# Altium project PCB_Snippets.PrjPcb
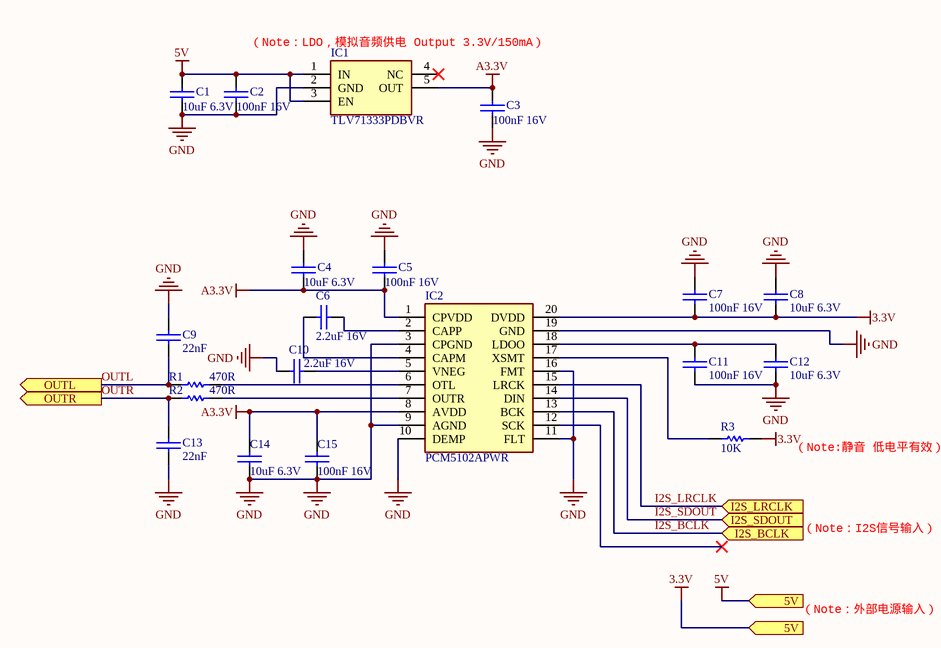
[diagram p0: PCM5102A .SchDoc]
1 sheet, 20 parts. Net scope: flat (ports and power ports of the same name join across sheets).
Board file: PCB1.PcbDoc

## Sheet PCM5102A .SchDoc
size A4

### Parts
C1  10uF 6.3V  [0603C]
C2  100nF 16V  [0402C]
C3  100nF 16V  [0402C]
C4  10uF 6.3V  [0603C]
C5  100nF 16V  [0402C]
C6  2.2uF 16V  [0402C]
C7  100nF 16V  [0402C]
C8  10uF 6.3V  [0603C]
C9  22nF  [0402C]
C10  2.2uF 16V  [0402C]
C11  100nF 16V  [0402C]
C12  10uF 6.3V  [0603C]
C13  22nF  [0402C]
C14  10uF 6.3V  [0603C]
C15  100nF 16V  [0402C]
IC1  TLV71333PDBVR  [SOT95P280X145-5N]
IC2  PCM5102APWR  [SOP65P640X120-20N]
R1  470R  [0402R]
R2  470R  [0402R]
R3  10K  [0402R]

### Ports
5V (in), I2S_BCLK (in), I2S_LRCLK (in), I2S_SDOUT (in), OUTL (out), OUTR (out)

### Nets
3.3V: C1.2 C2.2 C7.1 C8.1 IC1.1(IN) IC1.3(EN) IC2.20(DVDD) R3.1 ; port 5V  [also labelled 5V]
A3.3V: C3.2 C4.1 C5.1 C14.2 C15.2 IC1.5(OUT) IC2.1(CPVDD) IC2.8(AVDD)
GND: C1.1 C2.1 C3.1 C4.2 C5.2 C7.2 C8.2 C9.2 C10.2 C11.1 C12.1 C13.1 C14.1 C15.1 IC1.2(GND) IC2.3(CPGND) IC2.9(AGND) IC2.10(DEMP) IC2.11(FLT) IC2.16(FMT) IC2.19(GND)
I2S_BCLK: IC2.13(BCK) ; port I2S_BCLK
I2S_LRCLK: IC2.15(LRCK) ; port I2S_LRCLK
I2S_SDOUT: IC2.14(DIN) ; port I2S_SDOUT
OUTL: C9.1 R1.2 ; port OUTL
OUTR: C13.2 R2.2 ; port OUTR
NetC6_1: C6.1 IC2.2(CAPP)
NetC6_2: C6.2 IC2.4(CAPM)
NetC10_1: C10.1 IC2.5(VNEG)
NetC11_2: C11.2 C12.2 IC2.18(LDOO)
NetIC2_6: IC2.6(OTL) R1.1
NetIC2_7: IC2.7(OUTR) R2.1
NetIC2_17: IC2.17(XSMT) R3.2

Not connected (* = marked no-connect by the designer): IC1 4(NC)*; IC2 12(SCK)*

### Notes on the sheet
- (near IC1) （Note：LDO，模拟音频供电 Output 3.3V/150mA）
- （Note:静音 低电平有效）
- （Note：I2S信号输入）
- （Note：外部电源输入）

### Library data of the parts
C1-C15 = CAP-NP
IC1 = TLV71333PDBVR: Integrated Circuit; Manufacturer_Name: Texas Instruments; Datasheet Link: http://www.ti.com/lit/gpn/tlv713p; Height: 1.45mm; Manufacturer_Part_Number: TLV71333PDBVR; Arrow Part Number: TLV71333PDBVR; Arrow Price/Stock: https://www.arrow.com/en/products/tlv71333pdbvr/texas-instruments; Mouser Part Number: 595-TLV71333PDBVR; Mouser Price/Stock: https://www.mouser.co.uk/ProductDetail/Texas-Instruments/TLV71333PDBVR?qs=FBI%252BX3tnPf1lCQ%252BDbwaFmA%3D%3D
IC2 = PCM5102APWR: Integrated Circuit; Manufacturer_Name: Texas Instruments; Datasheet Link: https://componentsearchengine.com/Datasheets/2/PCM5102APWR.pdf; Height: 1.2mm; Manufacturer_Part_Number: PCM5102APWR; Arrow Part Number: PCM5102APWR; Arrow Price/Stock: https://www.arrow.com/en/products/pcm5102apwr/texas-instruments; Mouser Part Number: 595-PCM5102APWR; Mouser Price/Stock: https://www.mouser.co.uk/ProductDetail/Texas-Instruments/PCM5102APWR?qs=E2%2FxqS9xjzrfECkwEYoiyg%3D%3D
R1-R3 = RES